# EAGLE schematic Stroboman (EAGLE 7.2.0)
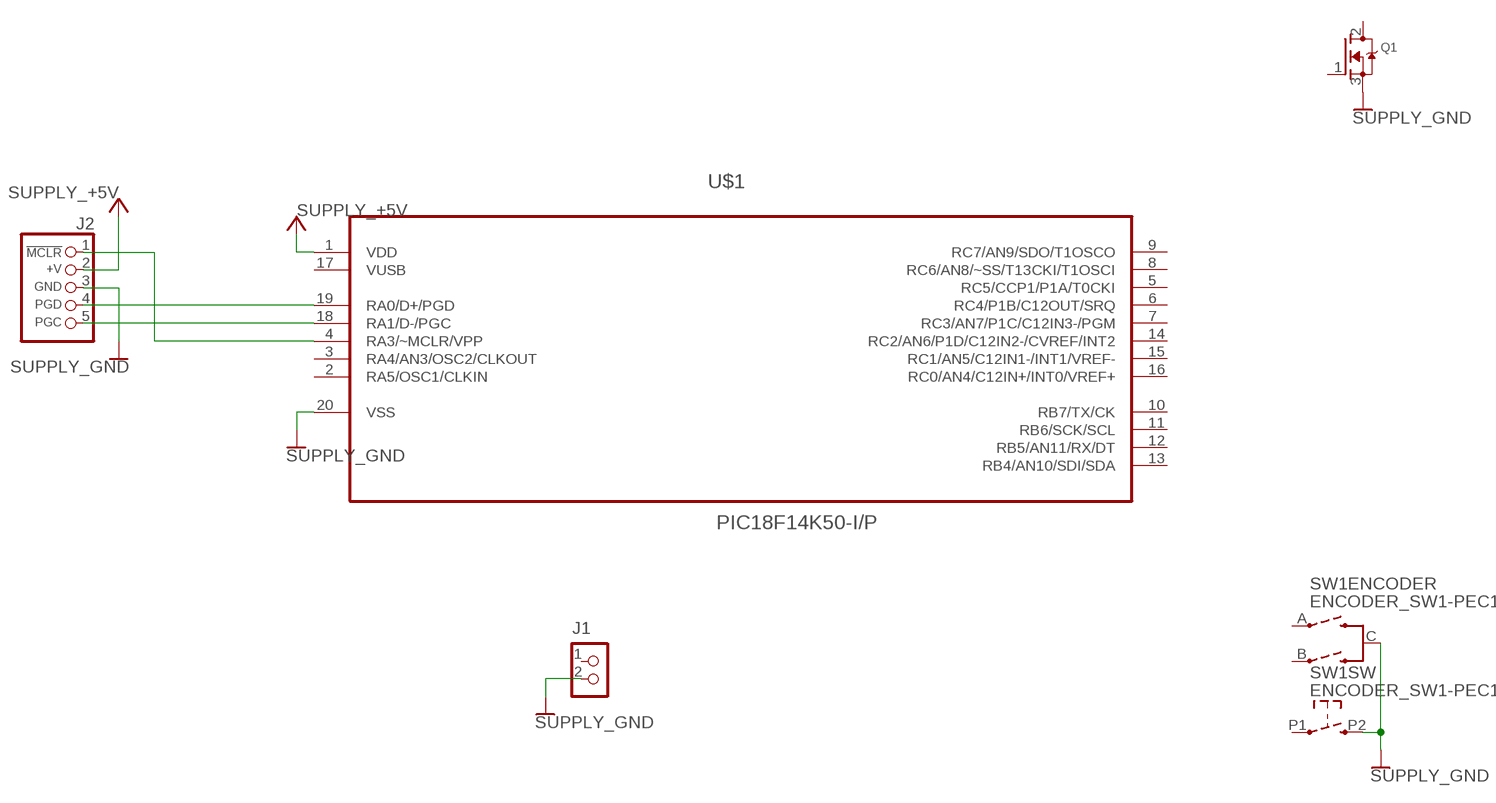
[diagram p0: schematic, sheet 1]

## Parts
J1  CON_HEADER_1X02-PTH  [M1X2]
J2  CON_HEADER_PRG_PIC_ICSP0.1INCH_B  [HEADER_PRG_1X05_ICSP_B]
Q1  MOSFET-NGDS_TO220V  [TO220V]
SW1  ENCODER_SW1-PEC12  [PEC12_INCREMENTAL_ENCODER]
U$1  PIC18F14K50-I/P  [DIP254P762X533-20]

## Nets
+5V: J2.2(+V) U$1.1(VDD) ; supply symbol labelled SUPPLY_+5V
GND: J1.2 J2.3(GND) Q1.3(S) SW1.C(ENCODER:C) SW1.P2 U$1.20(VSS) ; supply symbol labelled SUPPLY_GND
MCLR: J2.1(/MCLR) U$1.4(RA3/~MCLR/VPP)
PGC: J2.5(PGC) U$1.18(RA1/D-/PGC)
PGD: J2.4(PGD) U$1.19(RA0/D+/PGD)
Unconnected: J1.1 Q1.1(G) Q1.2(D) SW1.A(ENCODER:A) SW1.B(ENCODER:B) SW1.P1 U$1.2(RA5/OSC1/CLKIN) U$1.3(RA4/AN3/OSC2/CLKOUT) U$1.5(RC5/CCP1/P1A/T0CKI) U$1.6(RC4/P1B/C12OUT/SRQ) U$1.7(RC3/AN7/P1C/C12IN3-/PGM) U$1.8(RC6/AN8/~SS/T13CKI/T1OSCI) U$1.9(RC7/AN9/SDO/T1OSCO) U$1.10(RB7/TX/CK) U$1.11(RB6/SCK/SCL) U$1.12(RB5/AN11/RX/DT) U$1.13(RB4/AN10/SDI/SDA) U$1.14(RC2/AN6/P1D/C12IN2-/CVREF/INT2) U$1.15(RC1/AN5/C12IN1-/INT1/VREF-) U$1.16(RC0/AN4/C12IN+/INT0/VREF+)

## Power pins joined to a net without a drawn wire
VUSB: U$1.17(VUSB)

## Library data of the parts
J1 = dp_devices:CON_HEADER_1X02
J2 = dp_devices:CON_HEADER_PRG_PIC_ICSP: 5-pin PIC In Circuit Serial Programming header
Q1 = adafruit:MOSFET-N: N-Channel Mosfet 2N7002E - 60V 260mA SOT23 [Digikey: 2N7002ET1GOSTR-ND] - REEL BSH103 - 30V 850mA SOT23 [Digikey: 568-5013-1-ND]
SW1 = dp_devices:ENCODER_SW1: Incremental Encoder with push switch
U$1 = Microchip_By_element14_Batch_1:PIC18F14K50-I/P: USB Flash Microcontrollers; MPN: PIC18F14K50-I/P; OC_FARNELL: 1648501; OC_NEWARK: 77M3103; PACKAGE: DIP-20; SUPPLIER: Microchip